# Altium schematic sheet FPGA.SchDoc: FPGA
size A3; DocumentNumber: 9; Revision: 2.0; SheetNumber: 9; SheetTotal: 18
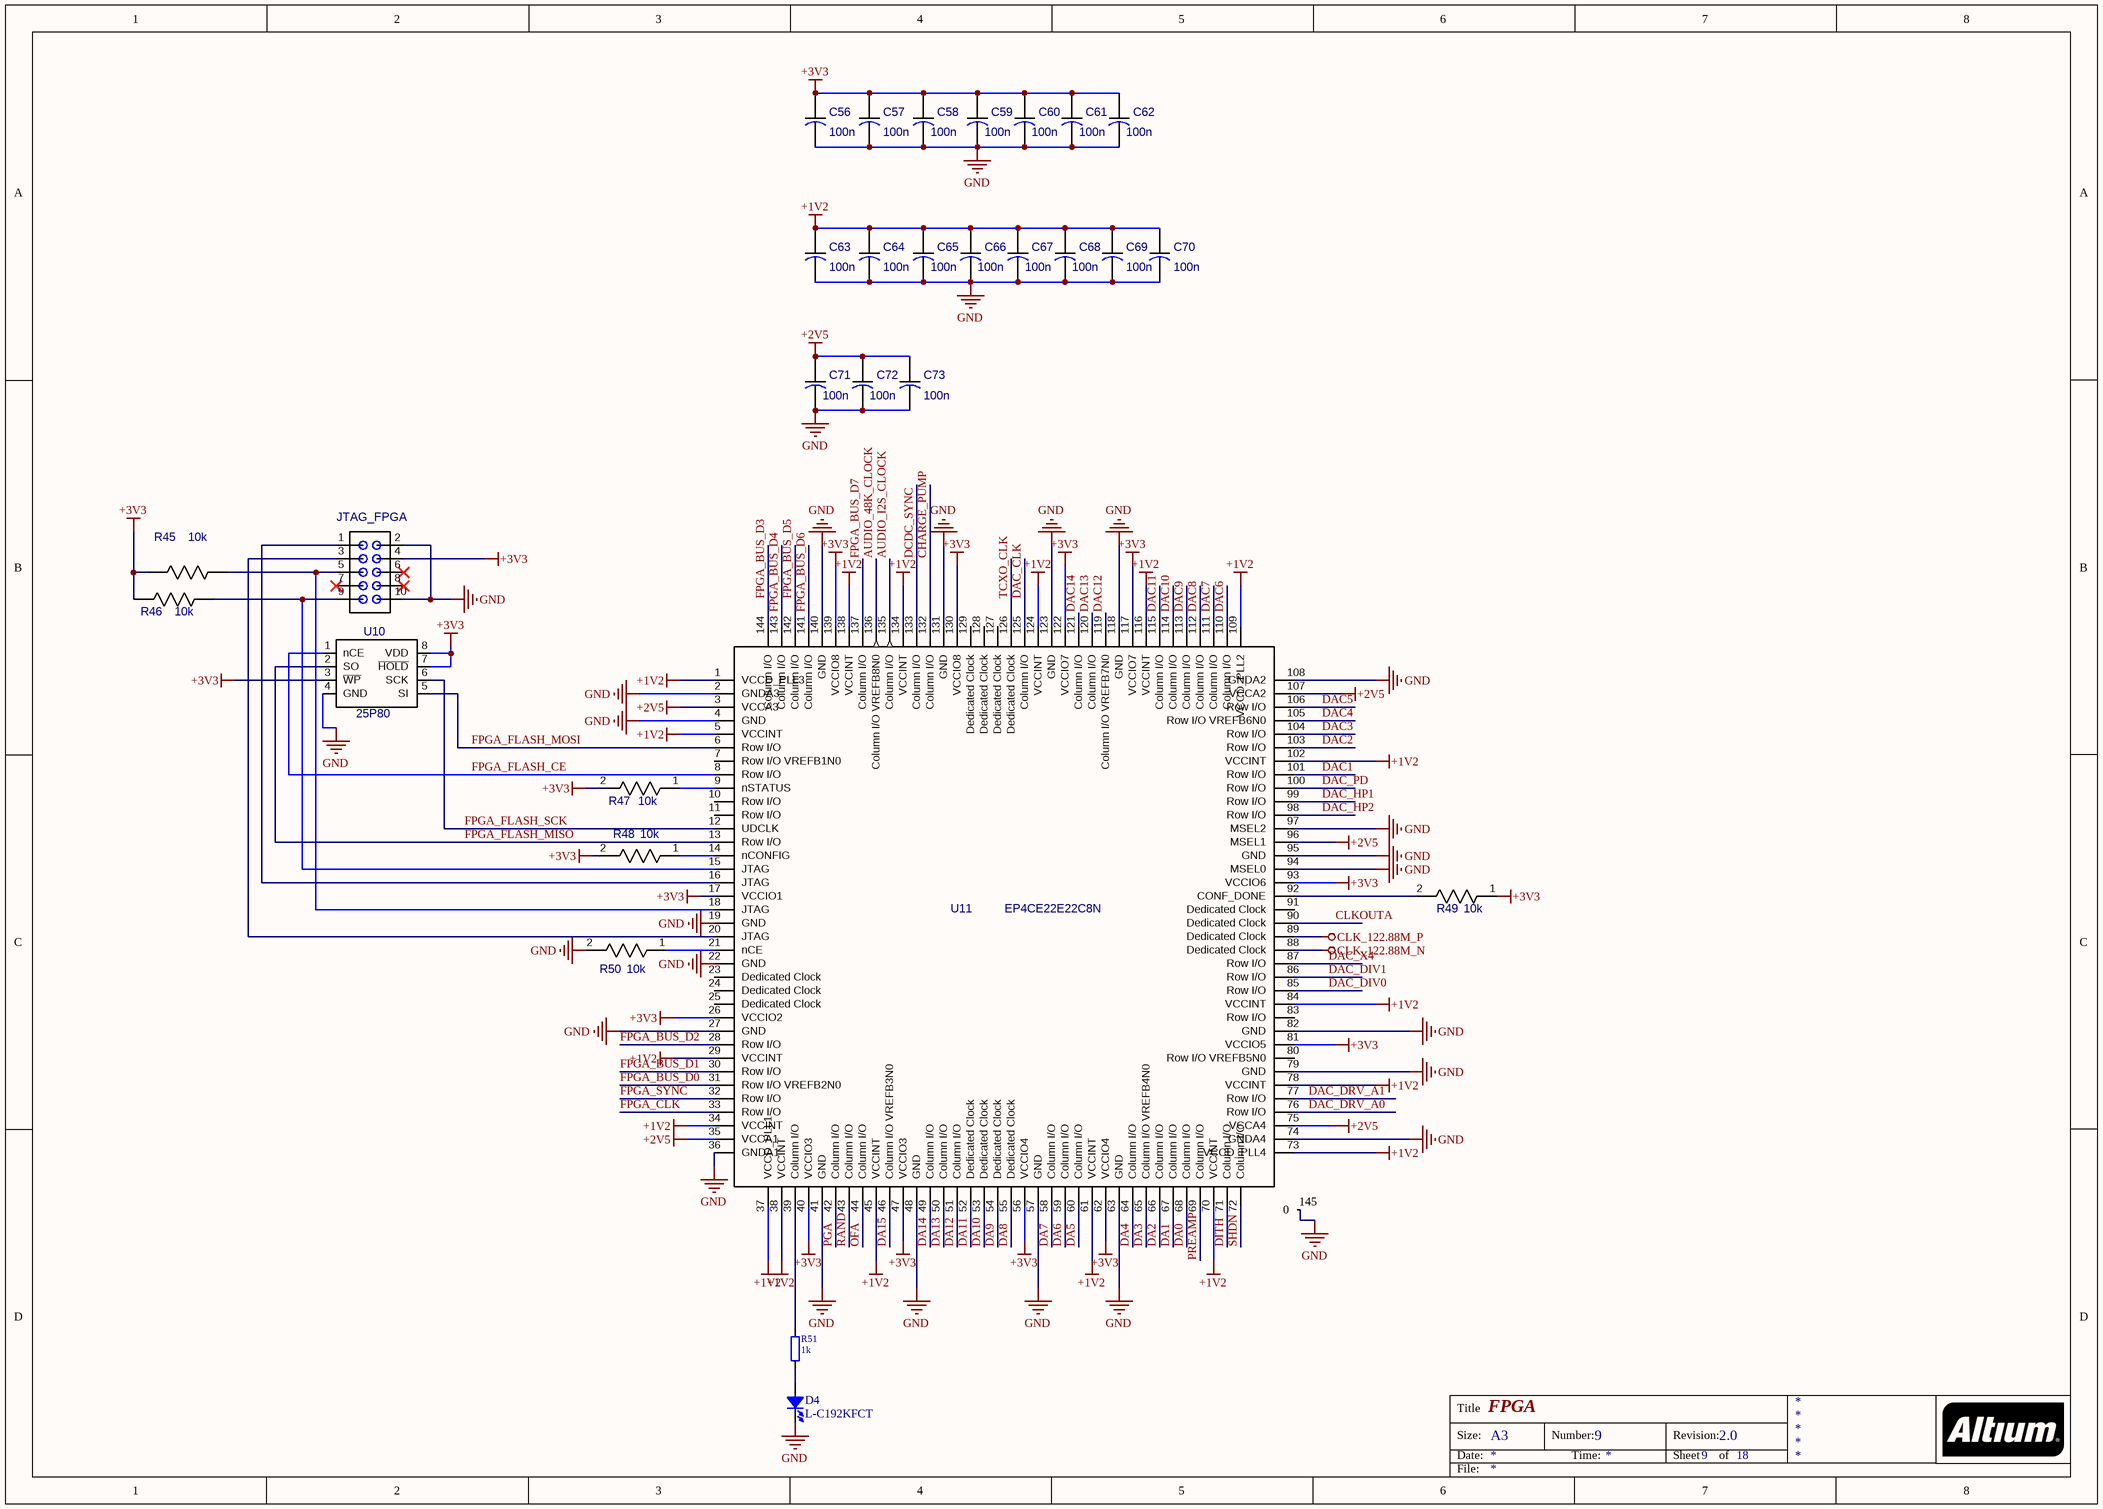
[diagram p0: FPGA.SchDoc]

## Parts
C56  100n  [CAP_0805]
C57  100n  [CAP_0805]
C58  100n  [CAP_0805]
C59  100n  [CAP_0805]
C60  100n  [CAP_0805]
C61  100n  [CAP_0805]
C62  100n  [CAP_0805]
C63  100n  [CAP_0805]
C64  100n  [CAP_0805]
C65  100n  [CAP_0805]
C66  100n  [CAP_0805]
C67  100n  [CAP_0805]
C68  100n  [CAP_0805]
C69  100n  [CAP_0805]
C70  100n  [CAP_0805]
C71  100n  [CAP_0805]
C72  100n  [CAP_0805]
C73  100n  [CAP_0805]
D4  L-C192KFCT  [LED 0603]
JTAG_FPGA  (no value)  [IDC10]
R45  10k  [RES_0805]
R46  10k  [RES_0805]
R47  10k  [RES_0805]
R48  10k  [RES_0805]
R49  10k  [RES_0805]
R50  10k  [RES_0805]
R51  1k  [R-0603]
U10  25P80  [25P80]
U11  EP4CE22E22C8N  [QFP144-20-2222A]

## Nets
+1V2: C63.1 C64.1 C65.1 C66.1 C67.1 C68.1 C69.1 C70.1 U11.1(VCCD_PLL3) U11.5(VCCINT) U11.29(VCCINT) U11.34(VCCINT) U11.37(VCCD_PLL1) U11.38(VCCINT) U11.45(VCCINT) U11.61(VCCINT) U11.70(VCCINT) U11.73(VCCD_PLL4) U11.78(VCCINT) U11.84(VCCINT) U11.102(VCCINT) U11.109(VCCD_PLL2) U11.116(VCCINT) U11.124(VCCINT) U11.134(VCCINT) U11.138(VCCINT)
+2V5: C71.1 C72.1 C73.1 U11.3(VCCA3) U11.35(VCCA1) U11.75(VCCA4) U11.96(MSEL1) U11.107(VCCA2)
+3V3: C56.1 C57.1 C58.1 C59.1 C60.1 C61.1 C62.1 JTAG_FPGA.4 R45.2 R46.2 R47.2 R48.2 R49.1 U10.3(~{WP}) U10.7(~{HOLD}) U10.8(VDD) U11.17(VCCIO1) U11.26(VCCIO2) U11.40(VCCIO3) U11.47(VCCIO3) U11.56(VCCIO4) U11.62(VCCIO4) U11.81(VCCIO5) U11.93(VCCIO6) U11.117(VCCIO7) U11.122(VCCIO7) U11.130(VCCIO8) U11.139(VCCIO8)
CLK_122.88M_N: U11.88(Dedicated_Clock)
CLK_122.88M_P: U11.89(Dedicated_Clock)
GND: C56.2 C57.2 C58.2 C59.2 C60.2 C61.2 C62.2 C63.2 C64.2 C65.2 C66.2 C67.2 C68.2 C69.2 C70.2 C71.2 C72.2 C73.2 D4.2 JTAG_FPGA.2 JTAG_FPGA.10 R50.2 U10.4(GND) U11.2(GNDA3) U11.4(GND) U11.19(GND) U11.22(GND) U11.27(GND) U11.36(GNDA1) U11.41(GND) U11.48(GND) U11.57(GND) U11.63(GND) U11.74(GNDA4) U11.79(GND) U11.82(GND) U11.94(MSEL0) U11.95(GND) U11.97(MSEL2) U11.108(GNDA2) U11.118(GND) U11.123(GND) U11.131(GND) U11.140(GND) U11.145(0)
AUDIO_48K_CLOCK: U11.136(Column_I/O_VREFB8N0)
AUDIO_I2S_CLOCK: U11.135(Column_I/O)
CHARGE_PUMP: U11.132(Column_I/O)
CLKOUTA: U11.90(Dedicated_Clock)
DA0: U11.68(Column_I/O)
DA1: U11.67(Column_I/O)
DA2: U11.66(Column_I/O)
DA3: U11.65(Column_I/O_VREFB4N0)
DA4: U11.64(Column_I/O)
DA5: U11.60(Column_I/O)
DA6: U11.59(Column_I/O)
DA7: U11.58(Column_I/O)
DA8: U11.55(Dedicated_Clock)
DA9: U11.54(Dedicated_Clock)
DA10: U11.53(Dedicated_Clock)
DA11: U11.52(Dedicated_Clock)
DA12: U11.51(Column_I/O)
DA13: U11.50(Column_I/O)
DA14: U11.49(Column_I/O)
DA15: U11.46(Column_I/O_VREFB3N0)
DAC1: U11.101(Row_I/O)
DAC2: U11.103(Row_I/O)
DAC3: U11.104(Row_I/O)
DAC4: U11.105(Row_I/O_VREFB6N0)
DAC5: U11.106(Row_I/O)
DAC6: U11.110(Column_I/O)
DAC7: U11.111(Column_I/O)
DAC8: U11.112(Column_I/O)
DAC9: U11.113(Column_I/O)
DAC10: U11.114(Column_I/O)
DAC11: U11.115(Column_I/O)
DAC12: U11.119(Column_I/O_VREFB7N0)
DAC13: U11.120(Column_I/O)
DAC14: U11.121(Column_I/O)
DAC_CLK: U11.125(Column_I/O)
DAC_DIV0: U11.85(Row_I/O)
DAC_DIV1: U11.86(Row_I/O)
DAC_DRV_A0: U11.76(Row_I/O)
DAC_DRV_A1: U11.77(Row_I/O)
DAC_HP1: U11.99(Row_I/O)
DAC_HP2: U11.98(Row_I/O)
DAC_PD: U11.100(Row_I/O)
DAC_X4: U11.87(Row_I/O)
DCDC_SYNC: U11.133(Column_I/O)
DITH: U11.71(Column_I/O)
FPGA_BUS_D0: U11.31(Row_I/O_VREFB2N0)
FPGA_BUS_D1: U11.30(Row_I/O)
FPGA_BUS_D2: U11.28(Row_I/O)
FPGA_BUS_D3: U11.144(Column_I/O)
FPGA_BUS_D4: U11.143(Column_I/O)
FPGA_BUS_D5: U11.142(Column_I/O)
FPGA_BUS_D6: U11.141(Column_I/O)
FPGA_BUS_D7: U11.137(Column_I/O)
FPGA_CLK: U11.33(Row_I/O)
FPGA_FLASH_CE: U10.1(nCE) U11.8(Row_I/O)
FPGA_FLASH_MISO: U10.2(SO) U11.13(Row_I/O)
FPGA_FLASH_MOSI: U10.5(SI) U11.6(Row_I/O)
FPGA_FLASH_SCK: U10.6(SCK) U11.12(UDCLK)
FPGA_SYNC: U11.32(Row_I/O)
OFA: U11.44(Column_I/O)
PGA: U11.42(Column_I/O)
PREAMP: U11.69(Column_I/O)
RAND: U11.43(Column_I/O)
SHDN: U11.72(Column_I/O)
TCXO_CLK: U11.126(Dedicated_Clock)
NetD4_1: D4.1 R51.1
NetJTAG_FPGA_1: JTAG_FPGA.1 U11.16(JTAG)
NetJTAG_FPGA_3: JTAG_FPGA.3 U11.20(JTAG)
NetJTAG_FPGA_5: JTAG_FPGA.5 R45.1 U11.18(JTAG)
NetJTAG_FPGA_9: JTAG_FPGA.9 R46.1 U11.15(JTAG)
NetR47_1: R47.1 U11.9(nSTATUS)
NetR48_1: R48.1 U11.14(nCONFIG)
NetR49_2: R49.2 U11.92(CONF_DONE)
NetR50_1: R50.1 U11.21(nCE)
NetR51_2: R51.2 U11.39(Column_I/O)

Not connected (* = marked no-connect by the designer): JTAG_FPGA 6* 7* 8*; U11 7(Row_I/O_VREFB1N0) 10(Row_I/O) 11(Row_I/O) 23(Dedicated_Clock) 24(Dedicated_Clock) 25(Dedicated_Clock) 80(Row_I/O_VREFB5N0) 83(Row_I/O) 91(Dedicated_Clock) 127(Dedicated_Clock) 128(Dedicated_Clock) 129(Dedicated_Clock)

## Notes on the sheet
- Title
- Size:
- Date:
- A3
- Number:
- Time:
- Revision:
- Sheet
- of
- File:

## Library data of the parts
C56-C73 = CAP_0805: Value: 100n
D4 = D LED: SMD LED Diode; Manufacturer: Paralight; Manufacturer P/N: L-C192KFCT
JTAG_FPGA = IDC10: 2*5 Pin
R45-R50 = RES_0805: Value: 10k
R51 = RES semi: Chip Resistor; Manufacturer: Yageo/Phycomp; Manufacturer P/N: RC0603FR-0749R9L; numsch: 021; TypeNum: 212; Parameters: 49.9R, RC, 0.1W, ±1%, TCR ±100ppm; Power: *; TCR: *; Series: *; Tolerance: *
U10 = 25P80: Value: 25P80
U11 = EP4CE22E22C8N: Value: EP4CE22E22C8N